# Altium schematic sheet MAGI'sBatteryPower.SchDoc
size A4
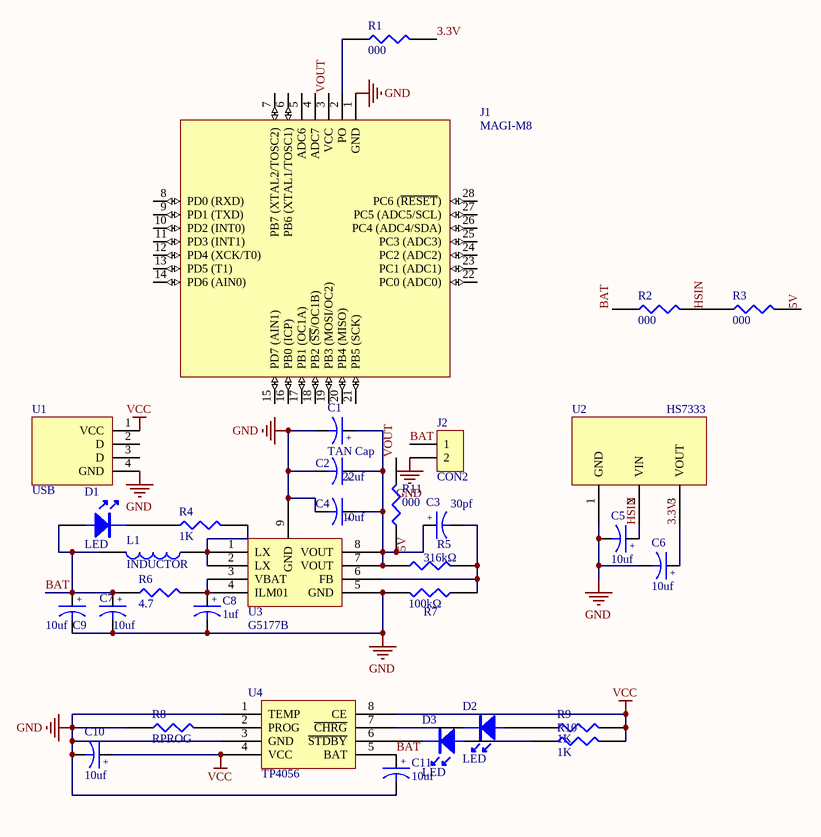
[diagram p0: MAGI'sBatteryPower.SchDoc]

## Parts
C1  TAN Cap  [TAN-D-7343]
C2  22uf  [14-1210]
C3  30pf  [6-0805_N]
C4  10uf  [6-0805_N]
C5  10uf  [6-0805_N]
C6  10uf  [6-0805_N]
C7  10uf  [6-0805_N]
C8  1uf  [6-0805_N]
C9  10uf  [6-0805_N]
C10  10uf  [6-0805_N]
C11  10uf  [6-0805_N]
D1  LED  [6-0805_N]
D2  LED  [6-0805_N]
D3  LED  [6-0805_N]
J1  MAGI-M8  [MAGI-M8]
J2  CON2  [CON2]
L1  INDUCTOR  [7*7]
R1  000  [6-0805_n]
R2  000  [1608[0603]]
R3  000  [1608[0603]]
R4  1K  [6-0805_N]
R5  316kΩ  [6-0805_N]
R6  4.7  [6-0805_N]
R7  100kΩ  [6-0805_N]
R8  RPROG  [6-0805_N]
R9  1K  [6-0805_N]
R10  1K  [6-0805_N]
R11  000  [6-0805_N]
U1  USB  [MicroUSB]
U2  HS7333  [HS7333]
U3  G5177B  [G5177B]
U4  TP4056  [TP4056]

## Nets
GND: C1.2 C2.2 C4.2 C5.2 C6.2 C7.2 C8.2 C9.2 C10.2 C11.2 J1.1(GND) J2.2 R7.2 R8.1 U1.4(GND) U2.1(GND) U3.5(GND) U3.9(GND) U4.1(TEMP) U4.3(GND)
VCC: C10.1 R9.2 R10.2 U1.1(VCC) U4.4(VCC) U4.8(CE)
3.3V: C6.1 R1.2 U2.3(VOUT)
5V: C1.1 C2.1 C3.1 C4.1 R3.2 R5.1 R11.1 U3.7(VOUT) U3.8(VOUT)
BAT: C7.1 C9.1 C11.1 D1.1 J2.1 L1.2 R2.1 R6.1 U4.5(BAT)
HSIN: C5.1 R2.2 R3.1 U2.2(VIN)
VOUT: J1.3(VCC) R11.2
NetC3_2: C3.2 R5.2 R7.1 U3.6(FB)
NetC8_1: C8.1 R6.2 U3.3(VBAT) U3.4(ILM01)
NetD1_2: D1.2 R4.1
NetD2_1: D2.1 R9.1
NetD2_2: D2.2 U4.7(~{CHRG})
NetD3_1: D3.1 R10.1
NetD3_2: D3.2 U4.6(~{STDBY})
NetJ1_2: J1.2(PO) R1.1
NetL1_1: L1.1 R4.2 U3.1(LX) U3.2(LX)
NetR8_2: R8.2 U4.2(PROG)

Not connected (* = marked no-connect by the designer): J1 4(ADC7) 5(ADC6) 6(PB6_(XTAL1/TOSC1)) 7(PB7_(XTAL2/TOSC2)) 8(PD0_(RXD)) 9(PD1_(TXD)) 10(PD2_(INT0)) 11(PD3_(INT1)) 12(PD4_(XCK/T0)) 13(PD5_(T1)) 14(PD6_(AIN0)) 15(PD7_(AIN1)) 16(PB0_(ICP)) 17(PB1_(OC1A)) 18(PB2_(~{SS}/OC1B)) 19(PB3_(MOSI/OC2)) 20(PB4_(MISO)) 21(PB5_(SCK)) 22(PC0_(ADC0)) 23(PC1_(ADC1)) 24(PC2_(ADC2)) 25(PC3_(ADC3)) 26(PC4_(ADC4/SDA)) 27(PC5_(ADC5/SCL)) 28(PC6_(~{RESET})); U1 2(D) 3(D)

## Notes on the sheet
- (in symbol CAPACITOR POL) +

## Library data of the parts
C1-C11 = CAPACITOR POL: Capacitor
J2 = CON2: Connector
R1-R11 = RES1